# EAGLE design schuifregister (EAGLE 9.6.2)
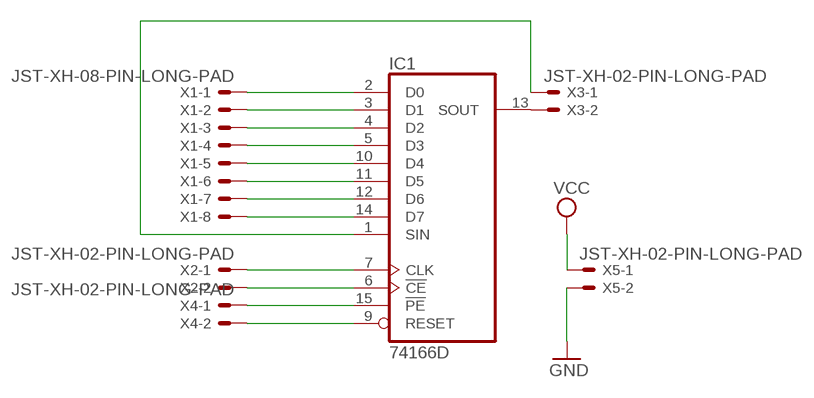
[diagram p0: schematic, sheet 1]

## Parts
IC1  74166D  [SO16]
X1  JST-XH-08-PIN-LONG-PAD  [JST-XH-08-PACKAGE-LONG-PAD]
X2  JST-XH-02-PIN-LONG-PAD  [JST-XH-02-PACKAGE-LONG-PAD]
X3  JST-XH-02-PIN-LONG-PAD  [JST-XH-02-PACKAGE-LONG-PAD]
X4  JST-XH-02-PIN-LONG-PAD  [JST-XH-02-PACKAGE-LONG-PAD]
X5  JST-XH-02-PIN-LONG-PAD  [JST-XH-02-PACKAGE-LONG-PAD]

## Nets
GND: X5.2
N$1: IC1.2(D0) X1.1
N$2: IC1.3(D1) X1.2
N$3: IC1.4(D2) X1.3
N$4: IC1.5(D3) X1.4
N$5: IC1.10(D4) X1.5
N$6: IC1.11(D5) X1.6
N$7: IC1.12(D6) X1.7
N$8: IC1.14(D7) X1.8
N$9: IC1.6(!CE) X2.2
N$10: IC1.7(CLK) X2.1
N$11: IC1.13(SOUT) X3.2
N$12: IC1.1(SIN) X3.1
N$13: IC1.9(RESET) X4.2
N$14: IC1.15(!PE) X4.1
VCC: X5.1

## Power pins joined to a net without a drawn wire
GND: IC1.8(GND)
VCC: IC1.16(VCC)

## Library data of the parts
IC1 = demo:74*166: 8-bit parallel load SHIFT REGISTER
X1 = Rembrandt Electronics - JST XH Connectors v1-0:JST-XH-08-PIN: JST XH Connector 2 Pin Wire to board connector. Pitch: 2,54 mm, (0.100") Number of pins: 8 Created by Rembrandt Electronics www.rembrandtelectronics.com
X2-X5 = Rembrandt Electronics - JST XH Connectors v1-0:JST-XH-02-PIN: JST XH Connector 2 Pin Wire to board connector. Pitch: 2,54 mm, (0.100") Number of pins: 2 Created by Rembrandt Electronics www.rembrandtelectronics.com

## Board
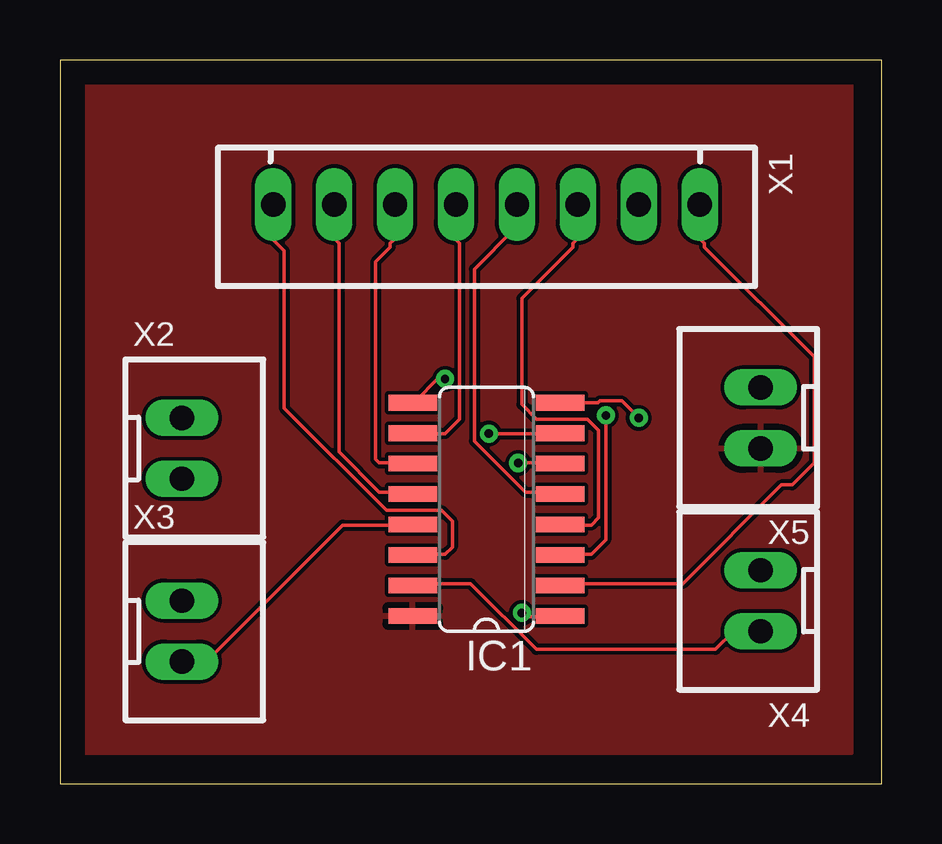
[diagram p1: board, top side]
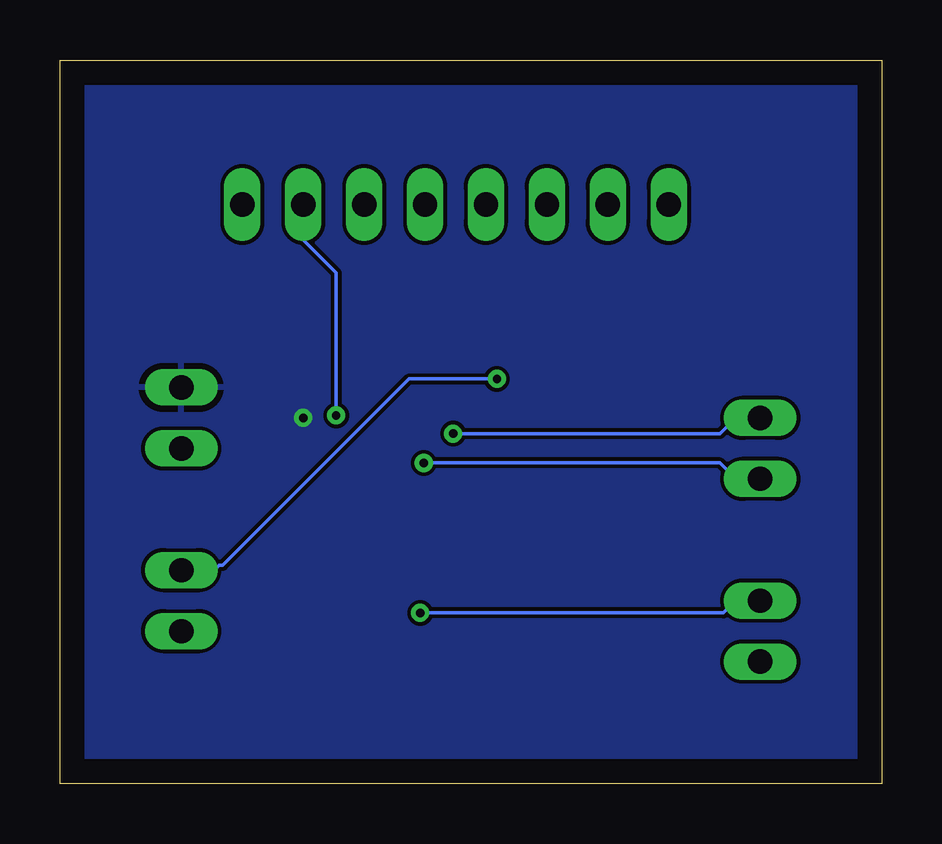
[diagram p2: board, bottom side, seen from below]

Size 34.27 x 30.15 mm. Coordinates in mm from the lower left corner, seen from the top.
Outline: 0,0 34.27,0 34.27,30.15 0,30.15 0,0
Copper layers (1*16): Top 0.035mm / dielectric 1.5mm / Bottom 0.035mm
Design rules "default": minimum track width 6mil, minimum drill 0.35mm, track to track 6mil, track to pad 6mil, pad to pad 6mil, via to via 6mil, smd to smd 6mil, copper to edge 40mil, drill to drill 6mil, minimum pad ring 10mil, minimum via ring 8mil, stop-mask expansion 4mil, vias tented up to drill 0mil, thermal gap 10mil

### Footprints (pad centres in the part's own frame; a part is rotated, then mirrored left to right if it is on the bottom)
SO16 = smd 0.66 x 2.032: 1 -4.445,-3.073; 2 -3.175,-3.073; 3 -1.905,-3.073; 4 -0.635,-3.073; 5 0.635,-3.073; 6 1.905,-3.073; 7 3.175,-3.073; 8 4.445,-3.073; 9 4.445,3.073; 10 3.175,3.073; 11 1.905,3.073; 12 0.635,3.073; 13 -0.635,3.073; 14 -1.905,3.073; 15 -3.175,3.073; 16 -4.445,3.073
JST-XH-08-PACKAGE-LONG-PAD = drill 1.016 long: 1 -8.89,0; 2 -6.35,0; 3 -3.81,0; 4 -1.27,0; 5 1.27,0; 6 3.81,0; 7 6.35,0; 8 8.89,0
JST-XH-02-PACKAGE-LONG-PAD = drill 1.016 long: 1 -1.27,0; 2 1.27,0

### Placement (x,y rotation side)
IC1  17.78,11.43 90 top
X1  17.78,24.13 180 top
X2  5.08,13.97 270 top
X3  5.08,6.35 270 top
X4  29.21,7.62 90 top
X5  29.21,15.24 90 top

### Tracks (layer width: path | path; a pad name or v marks a point on that pad's centre or on a via)
GND  (via drill 0.35)
  Top 0.152: 20.93,15.95 IC1.8 22.43,15.88 22.51,15.95 22.86,15.95 23.42,15.95 v24.13,15.24
  pour Bottom: 0,0 0,43.18 48.26,43.18 48.26,0
N$1
  Top 0.152: IC1.2 20.93,8.33 25.96,8.33 30.07,12.45 30.53,12.45 31.45,13.36 31.45,17.78 26.87,22.35 26.87,22.5 26.72,22.66 26.72,24.03 X1.1
N$2  (via drill 0.35)
  Top 0.152: v22.76,15.34 22.76,10.16 22.15,9.55 20.93,9.55 IC1.3
  Bottom 0.152: v22.76,15.34 22.76,21.29 24.13,22.66 X1.2
N$3
  Top 0.152: IC1.4 20.93,10.77 22.15,10.77 22.45,11.07 22.45,14.73 22,15.19 19.86,15.19 19.25,15.8 19.25,20.22 21.39,22.35 21.39,22.5 21.54,22.66 21.54,24.03 X1.3
N$4
  Top 0.152: IC1.5 20.78,12.14 19.41,12.14 17.27,14.28 17.27,21.44 18.95,23.11 18.95,24.03 X1.4
N$5
  Top 0.152: X1.5 16.51,22.66 16.66,22.5 16.66,15.19 16.05,14.58 14.83,14.58 IC1.10
N$6
  Top 0.152: IC1.11 14.68,13.36 13.31,13.36 13.16,13.51 13.16,21.74 13.77,22.35 13.77,22.5 13.92,22.66 13.92,24.03 X1.6
N$7
  Top 0.152: IC1.12 14.68,12.14 13.31,12.14 11.63,13.82 11.63,22.5 11.48,22.66 11.48,24.03 X1.7
N$8
  Top 0.152: X1.8 8.89,22.66 9.35,22.2 9.35,15.65 13.61,11.38 15.9,11.38 16.36,10.92 16.36,9.86 16.05,9.55 14.83,9.55 IC1.14
N$9  (via drill 0.35)
  Top 0.152: v19.1,13.36 20.78,13.36 IC1.6
  Bottom 0.152: v19.1,13.36 6.76,13.36 6.15,12.75 5.08,12.75 X2.2
N$10  (via drill 0.35)
  Top 0.152: v17.88,14.58 20.78,14.58 IC1.7
  Bottom 0.152: v17.88,14.58 6.76,14.58 6.15,15.19 5.08,15.19 X2.1
N$11
  Top 0.152: IC1.13 14.68,10.77 11.79,10.77 6.15,5.13 5.08,5.13 X3.2
N$12  (via drill 0.35)
  Top 0.152: v19.25,7.11 19.41,6.96 20.78,6.96 IC1.1
  Bottom 0.152: v19.25,7.11 6.6,7.11 6.15,7.57 5.08,7.57 X3.1
N$13  (via drill 0.35)
  Top 0.152: v16.05,16.87 15.75,16.87 14.83,15.95 IC1.9
  Bottom 0.152: v16.05,16.87 19.71,16.87 27.48,9.09 27.64,9.09 27.79,8.94 29.16,8.94 X4.2
N$14
  Top 0.152: X4.1 28.09,6.35 27.33,5.59 19.86,5.59 17.12,8.33 14.83,8.33 IC1.15
VCC
  pour Top: 0,1.27 0,30.48 33.02,30.48 33.02,1.27